# Altium schematic sheet attenuator.SchDoc
size A; SheetNumber: 5
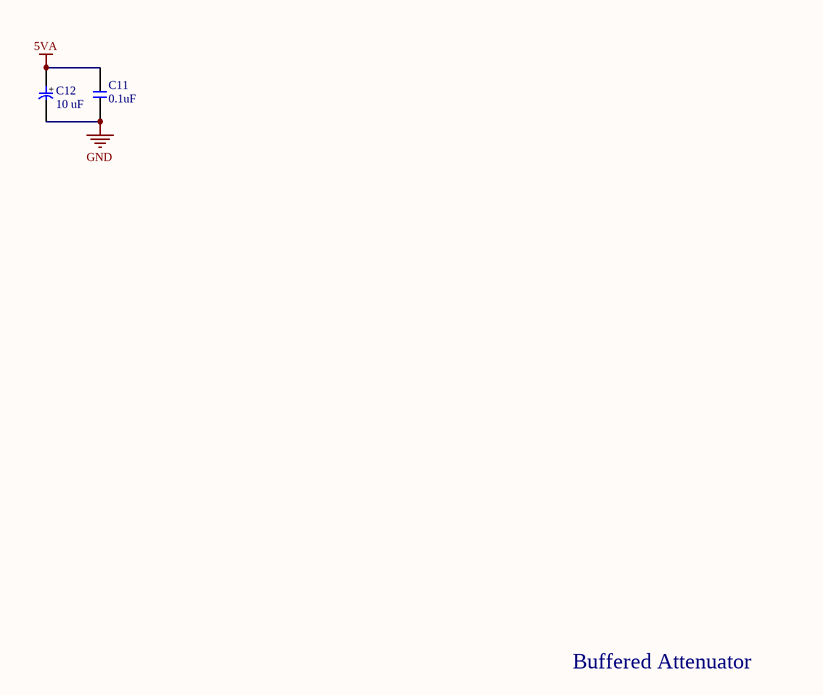
[diagram p0: attenuator.SchDoc]

## Parts
C11  0.1uF  [0603]
C12  10 uF  [KEMET 1411]

## Nets
5VA: C11.2 C12.1(+)
GND: C11.1 C12.2(-)

## Notes on the sheet
- Buffered Attenuator

## Library data of the parts
C11 = C0.1uF
C12 = C10uF Electro.